# Altium schematic sheet FingerPrint.SchDoc: BluetoothGateway
size A; DrawnBy: Q.Thang & T.Khoa; Revision: V1.0.0; SheetNumber: 11; SheetTotal: 17
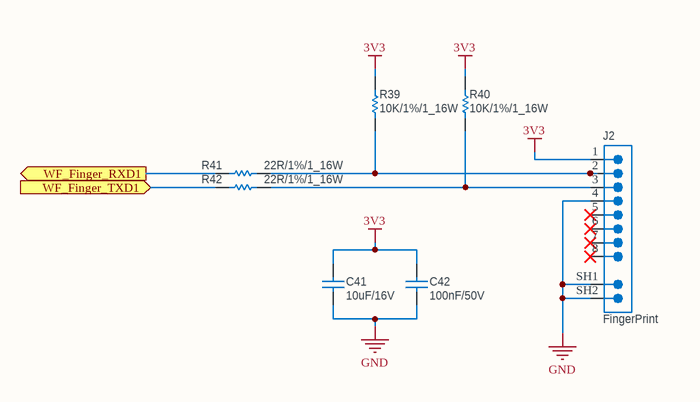
[diagram p0: FingerPrint.SchDoc]

## Parts
C41  10uF/16V  [CAP_0603]
C42  100nF/50V  [CAP_0603]
J2  FingerPrint  [MX_1.25mm_8P]
R39  10K/1%/1_16W  [RESISTOR_0402]
R40  10K/1%/1_16W  [RESISTOR_0402]
R41  22R/1%/1_16W  [RESISTOR_0402]
R42  22R/1%/1_16W  [RESISTOR_0402]

## Ports
WF_Finger_RXD1 (out, see Overview_Schematic[6B], ESP32_WiFi[3A]), WF_Finger_TXD1 (in, see Overview_Schematic[6A], ESP32_WiFi[3A])

## Nets
3V3: C41.2 C42.2 J2.1 R39.2 R40.2
GND: C41.1 C42.1 J2.4 J2.SH1(SHIELD) J2.SH2(SHIELD)
WF_Finger_RXD1: R41.1 ; port WF_Finger_RXD1
WF_Finger_TXD1: R42.1 ; port WF_Finger_TXD1
NetJ2_2: J2.2 R39.1 R41.2
NetJ2_3: J2.3 R40.1 R42.2

Not connected (* = marked no-connect by the designer): J2 5* 6* 7* 8*

## Notes on the sheet
- Project Name
- Size
- A4
- Revision
- Checked By:
- Drawn By:
- Date:
- File:
- Last Modified:
- Sheet
- of

## Library data of the parts
C41 = Ceramic_Cap_10uF_16V_0603: CAP, size 0603, 10uF, 16V; Supply Part Number: Tụ Gốm 0603 10uF 16V; Supply Name: Thegioiic; Datasheet: *; Supply URL: https://www.thegioiic.com/tu-gom-0603-10uf-16v
C42 = Ceramic_Cap_100nF_50V_0603: CAP, size 0603, 100nF, 50V; Supply Part Number: Tụ Gốm 0603 100nF (0.1uF) 50V; Supply Name: Thegioiic; Datasheet: *; Supply URL: https://www.thegioiic.com/tu-gom-0603-100nf-0-1uf-50v
J2 = MX_1.25mm_8P: Đầu MX1.25mm 8 Chân Dán SMD Thẳng Đứng; Supply Name: Thegioiic; Supply Part Number: Đầu MX1.25mm 8 Chân Dán SMD Thẳng Đứng; Supply URL: https://www.thegioiic.com/dau-mx1-25mm-8-chan-dan-smd-thang-dung
R39 R40 = Res_10K_0402_1%: Resistor 0402 10KOhm 1% 1_16W; Supply Part Number: Điện Trở 10 KOhm 0402 1%; Supply Name: Thegioiic; Supply URL: https://www.thegioiic.com/dien-tro-10-kohm-0402-1-
R41 R42 = Res_22R_0402_1%: Resistor 0402 22 Ohm 1% 1_16W; Supply Name: *; Supply Part Number: *; Supply URL: *